# EAGLE design WatchX-BASIC-TOP (EAGLE 9.6.2)
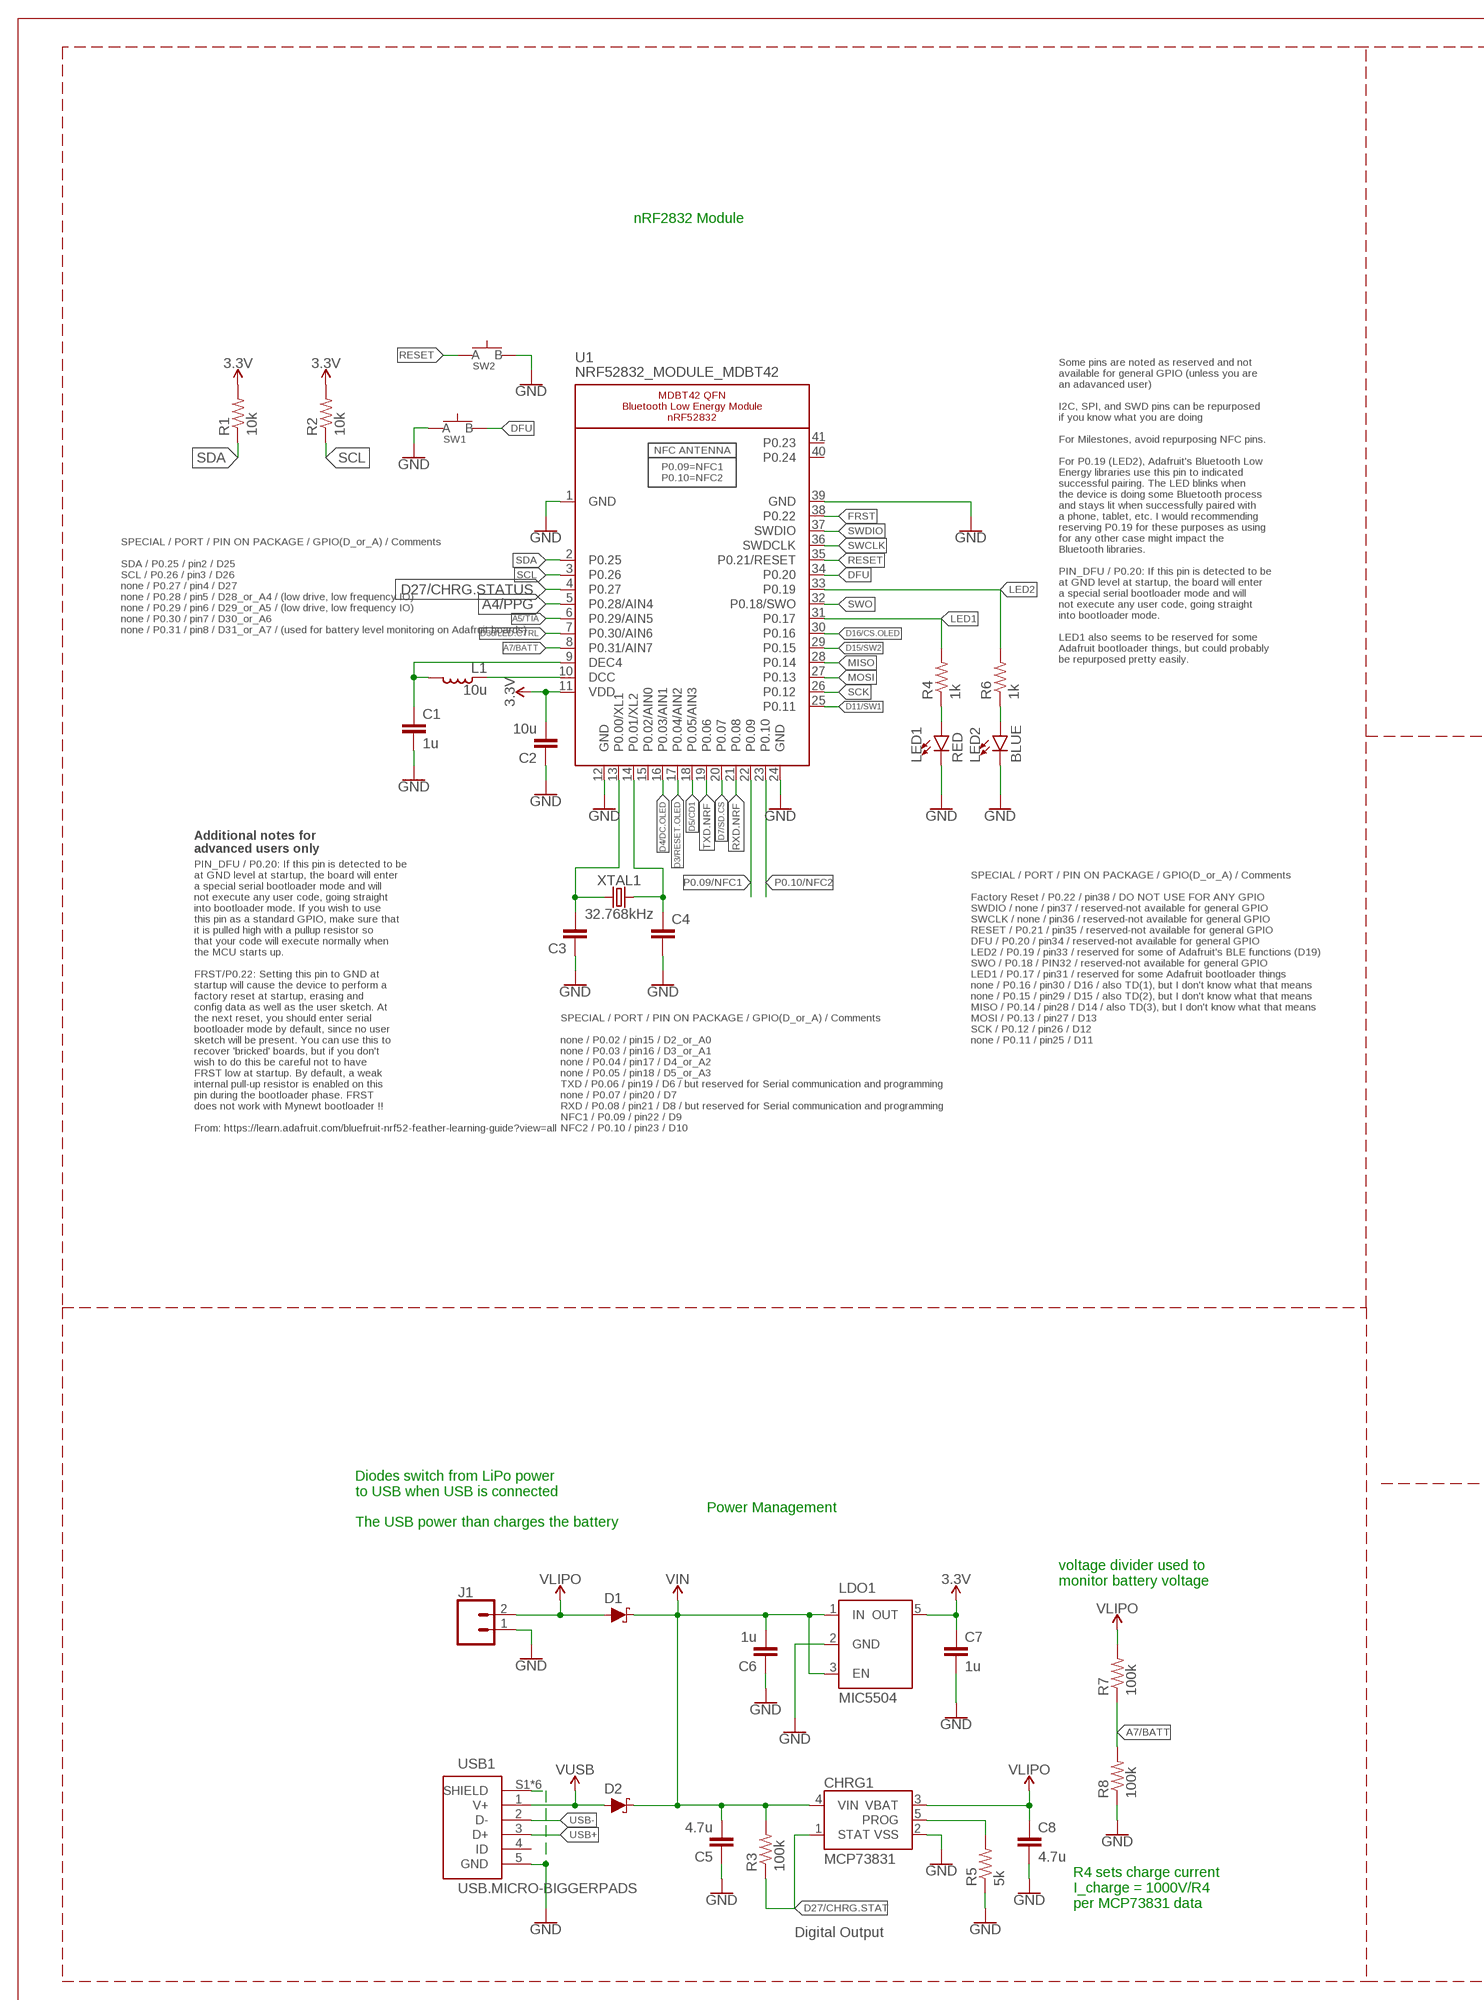
[diagram p0: schematic, sheet 1, part 1 of 2]
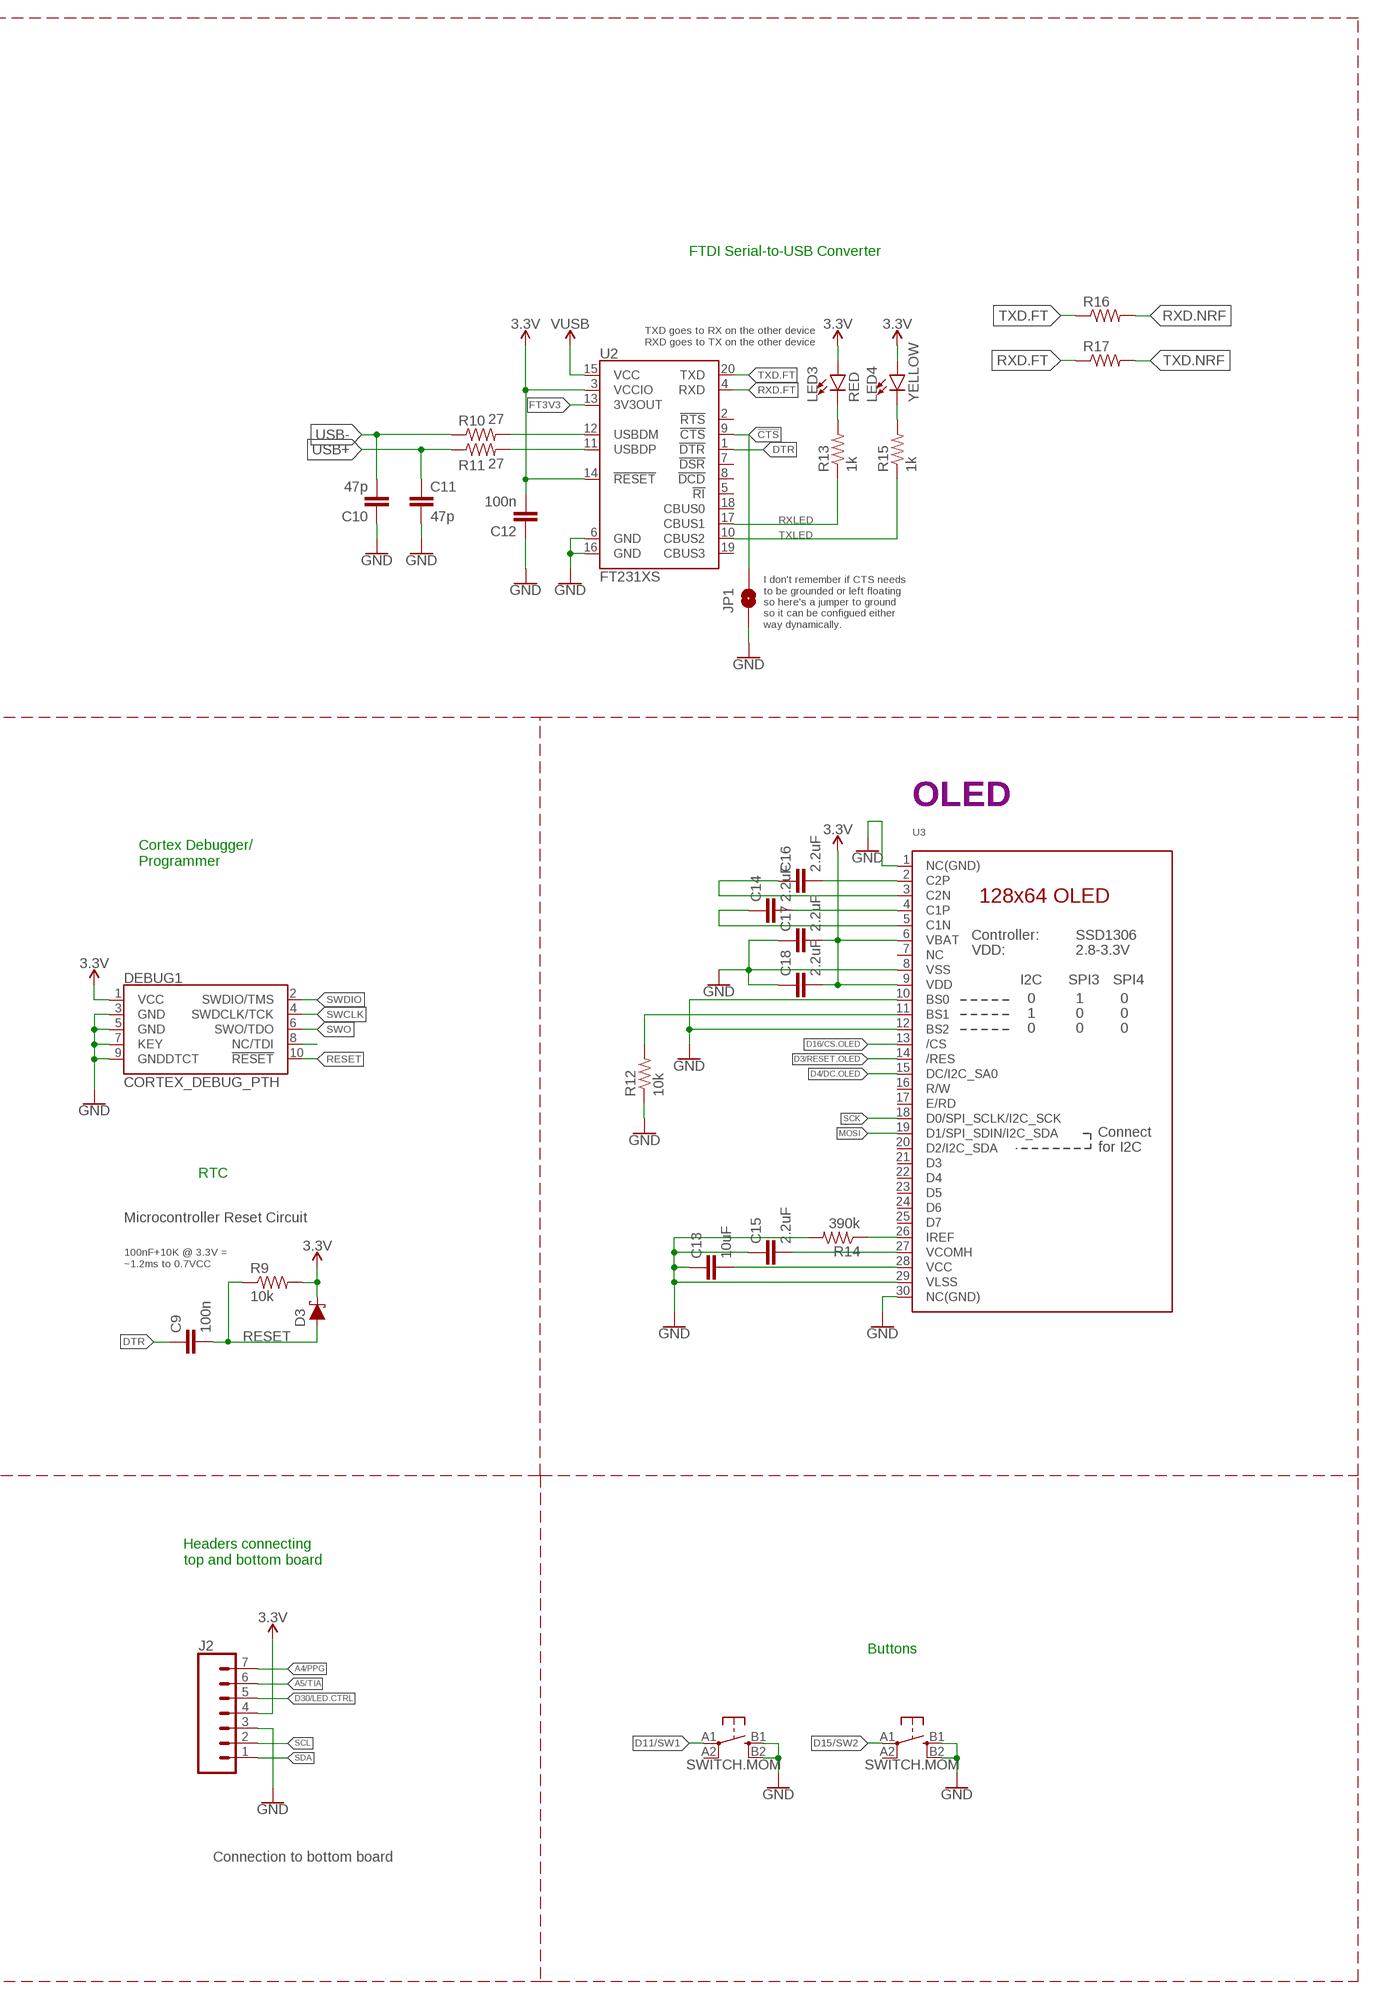
[diagram p1: schematic, sheet 1, part 2 of 2]

## Parts
C1  1u  CAPACITOR0603  [C0603]
C2  10u  CAPACITOR0805  [C0805]
C3  CAPACITOR0603  [C0603]
C4  CAPACITOR0603  [C0603]
C5  4.7u  CAPACITOR0603  [C0603]
C6  1u  CAPACITOR0603  [C0603]
C7  1u  CAPACITOR0603  [C0603]
C8  4.7u  CAPACITOR0603  [C0603]
C9  100n  CAPACITOR0603  [C0603]
C10  47p  CAPACITOR0603  [C0603]
C11  47p  CAPACITOR0603  [C0603]
C12  100n  CAPACITOR0603  [C0603]
C13  10uF  CAPACITOR0603  [C0603]
C14  2.2uF  CAPACITOR0402  [C0402]
C15  2.2uF  CAPACITOR0603  [C0603]
C16  2.2uF  CAPACITOR0402  [C0402]
C17  2.2uF  CAPACITOR0402  [C0402]
C18  2.2uF  CAPACITOR0402  [C0402]
CHRG1  MCP73831  [SOT23-5]
D1  SCHOTTKY-USC  [USC]
D2  SCHOTTKY-USC  [USC]
D3  SCHOTTKY-USC  [USC]
DEBUG1  CORTEX_DEBUG_PTH  [2X5-PTH-1.27MM]
J1  CONN_02  [1X02]
J2  CONN_07-1.27MM  [1X07_1.27MM]
JP1  JUMPER-SMT_2_NO_SILK  [SMT-JUMPER_2_NO_SILK]
L1  10u  INDUCTOR0603  [L0603]
LDO1  MIC5504  [SOT23-5]
LED1  RED  LED0603  [LED-0603]
LED2  BLUE  LED0603  [LED-0603]
LED3  RED  LED0603  [LED-0603]
LED4  YELLOW  LED0603  [LED-0603]
R1  10k  RESISTOR0603  [R0603]
R2  10k  RESISTOR0603  [R0603]
R3  100k  RESISTOR0603  [R0603]
R4  1k  RESISTOR0603  [R0603]
R5  5k  RESISTOR0603  [R0603]
R6  1k  RESISTOR0603  [R0603]
R7  100k  RESISTOR0603  [R0603]
R8  100k  RESISTOR0603  [R0603]
R9  10k  RESISTOR0603  [R0603]
R10  27  RESISTOR0603  [R0603]
R11  27  RESISTOR0603  [R0603]
R12  10k  RESISTOR0603  [R0603]
R13  1k  RESISTOR0603  [R0603]
R14  390k  RESISTOR0603  [R0603]
R15  1k  RESISTOR0603  [R0603]
R16  RESISTOR0603  [R0603]
R17  RESISTOR0603  [R0603]
SW1  SPST-PTS830GG140-COPY.1-3  [BUTTON-GULLWING]
SW2  SPST-PTS830GG140-COPY.1-3  [BUTTON-GULLWING]
SW3  SWITCH.MOM  [TACTILE_SWITCH_SMD_6.2MM_TALL]
SW4  SWITCH.MOM  [TACTILE_SWITCH_SMD_6.2MM_TALL]
U1  NRF52832_MODULE_MDBT42  [BLE_MODULE_RAYTAC_MDBT42]
U2  FT231XS  [SSOP20_L]
U3  DISP_OLED_UG-2864HSWEG01-NO-WRAPAROUND  [UG-2864HSWEG01_0.96IN_NO-WRAPAROUND]
USB1  USB.MICRO-BIGGERPADS  [USB-MICRO-01.BIGGERPADS]
XTAL1  32.768kHz  CRYSTALECS-.327-12.5-12-C-TR  [2-SMD.NOLEAD.2.0MMTO1.2MM]

## Nets
3.3V: C2.2 C7.1 C12.2 C17.2 C18.2 D3.-(C) DEBUG1.1(VCC) J2.4 LDO1.5(OUT) LED3.A LED4.A R1.2 R2.2 R9.2 U1.11(VDD) U2.3(VCCIO) U2.14(!RESET) U3.6(VBAT) U3.9(VDD)
!CTS: JP1.2 U2.9(!CTS)
A4/PPG: J2.7 U1.5(P0.28/AIN4)
A5/TIA: J2.6 U1.6(P0.29/AIN5)
A7/BATT: R7.1 R8.2 U1.8(P0.31/AIN7)
D3/RESET.OLED: U1.17(P0.04/AIN2) U3.14(/RES)
D4/DC.OLED: U1.16(P0.03/AIN1) U3.15(DC/I2C_SA0)
D5/CD1: U1.18(P0.05/AIN3)
D7/SD.CS: U1.20(P0.07)
D11/SW1: SW3.A1 U1.25(P0.11)
D15/SW2: SW4.A1 U1.29(P0.15)
D16/CS.OLED: U1.30(P0.16) U3.13(/CS)
D27/CHRG.STAT: CHRG1.1(STAT) R3.1
D27/CHRG.STATUS: U1.4(P0.27)
D30/LED.CTRL: J2.5 U1.7(P0.30/AIN6)
DFU: SW1.3(B) U1.34(P0.20)
DTR: C9.1 U2.1(!DTR)
FRST: U1.38(P0.22)
FT3V3: U2.13(3V3OUT)
GND: C1.2 C2.1 C3.1 C4.2 C5.1 C6.1 C7.2 C8.2 C10.1 C11.2 C12.1 C13.1 C15.1 C17.1 C18.1 CHRG1.2(VSS) DEBUG1.3(GND) DEBUG1.5(GND) DEBUG1.7(KEY) DEBUG1.9(GNDDTCT) J1.1 J2.3 JP1.1 LDO1.2(GND) LED1.C LED2.C R5.1 R8.1 R12.1 R14.2 SW1.1(A) SW2.3(B) SW3.B1 SW3.B2 SW4.B1 SW4.B2 U1.1(GND) U1.12(GND) U1.24(GND) U1.39(GND) U2.6(GND) U2.16(GND) U3.1(NC(GND)) U3.8(VSS) U3.10(BS0) U3.12(BS2) U3.29(VLSS) U3.30(NC(GND)) USB1.5(GND) USB1.S1(SHIELD) USB1.S2(SHIELD) USB1.S3(SHIELD) USB1.S4(SHIELD) USB1.S5(SHIELD) USB1.S6(SHIELD)
LED1: R4.2 U1.31(P0.17)
LED2: R6.2 U1.33(P0.19)
MISO: U1.28(P0.14)
MOSI: U1.27(P0.13) U3.19(D1/SPI_SDIN/I2C_SDA)
N$1: R12.2 U3.11(BS1)
N$2: R14.1 U3.26(IREF)
N$3: C16.2 U3.2(C2P)
N$4: C3.2 U1.13(P0.00/XL1) XTAL1.P$1
N$5: C16.1 U3.3(C2N)
N$6: C4.1 U1.14(P0.01/XL2) XTAL1.P$2
N$7: C14.2 U3.4(C1P)
N$8: C14.1 U3.5(C1N)
N$9: LED1.A R4.1
N$10: LED2.A R6.1
N$11: L1.1 U1.10(DCC)
N$12: C1.1 L1.2 U1.9(DEC4)
N$13: C13.2 U3.28(VCC)
N$14: DEBUG1.8(NC/TDI)
N$15: C15.2 U3.27(VCOMH)
N$17: CHRG1.5(PROG) R5.2
N$23: R10.2 U2.12(USBDM)
N$24: R11.2 U2.11(USBDP)
N$25: LED3.C R13.2
N$26: LED4.C R15.2
P0.09/NFC1: U1.22(P0.09)
P0.10/NFC2: U1.23(P0.10)
RESET: C9.2 D3.+(A) DEBUG1.10(!RESET) R9.1 SW2.1(A) U1.35(P0.21/RESET)
RXD.FT: R17.1 U2.4(RXD)
RXD.NRF: R16.2 U1.21(P0.08)
RXLED: R13.1 U2.17(CBUS1)
SCK: U1.26(P0.12) U3.18(D0/SPI_SCLK/I2C_SCK)
SCL: J2.2 R2.1 U1.3(P0.26)
SDA: J2.1 R1.1 U1.2(P0.25)
SWCLK: DEBUG1.4(SWDCLK/TCK) U1.36(SWDCLK)
SWDIO: DEBUG1.2(SWDIO/TMS) U1.37(SWDIO)
SWO: DEBUG1.6(SWO/TDO) U1.32(P0.18/SWO)
TXD.FT: R16.1 U2.20(TXD)
TXD.NRF: R17.2 U1.19(P0.06)
TXLED: R15.1 U2.10(CBUS2)
USB+: C11.1 R11.1 USB1.3(D+)
USB-: C10.2 R10.1 USB1.2(D-)
V_USB: D2.+(A) U2.15(VCC) USB1.1(V+) ; supply symbol labelled VUSB
VIN: C5.2 C6.2 CHRG1.4(VIN) D1.-(C) D2.-(C) LDO1.1(IN) LDO1.3(EN) R3.2
VLIPO: C8.1 CHRG1.3(VBAT) D1.+(A) J1.2 R7.2
Unconnected: SW3.A2 SW4.A2 U1.15(P0.02/AIN0) U1.40(P0.24) U1.41(P0.23) U2.2(!RTS) U2.5(!RI) U2.7(!DSR) U2.8(!DCD) U2.18(CBUS0) U2.19(CBUS3) U3.7(NC) U3.16(R/W) U3.17(E/RD) U3.20(D2/I2C_SDA) U3.21(D3) U3.22(D4) U3.23(D5) U3.24(D6) U3.25(D7) USB1.4(ID)

## Notes on the sheet
- nRF2832 Module
- FTDI Serial-to-USB Converter
- TXD goes to RX on the other device
  RXD goes to TX on the other device
- SPECIAL / PORT / PIN ON PACKAGE / GPIO(D_or_A) / Comments
  
  SDA / P0.25 / pin2 / D25
  SCL / P0.26 / pin3 / D26
  none / P0.27 / pin4 / D27
  none / P0.28 / pin5 / D28_or_A4 / (low drive, low frequency IO)
  none / P0.29 / pin6 / D29_or_A5 / (low drive, low frequency IO)
  none / P0.30 / pin7 / D30_or_A6
  none / P0.31 / pin8 / D31_or_A7 / (used for battery level monitoring on Adafruit boards)
- I don't remember if CTS needs
  to be grounded or left floating
  so here's a jumper to ground
  so it can be configued either
  way dynamically.
- Some pins are noted as reserved and not
  available for general GPIO (unless you are
  an adavanced user)
  
  I2C, SPI, and SWD pins can be repurposed
  if you know what you are doing
  
  For Milestones, avoid repurposing NFC pins.
  
  For P0.19 (LED2), Adafruit's Bluetooth Low
  Energy libraries use this pin to indicated
  successful pairing. The LED blinks when
  the device is doing some Bluetooth process
  and stays lit when successfully paired with
  a phone, tablet, etc. I would recommending
  reserving P0.19 for these purposes as using
  for any other case might impact the
  Bluetooth libraries.
  
  PIN_DFU / P0.20: If this pin is detected to be
  at GND level at startup, the board will enter
  a special serial bootloader mode and will
  not execute any user code, going straight
  into bootloader mode.
  
  LED1 also seems to be reserved for some
  Adafruit bootloader things, but could probably
  be repurposed pretty easily.
- OLED
- Additional notes for
  advanced users only
- Cortex Debugger/
  Programmer
- SPECIAL / PORT / PIN ON PACKAGE / GPIO(D_or_A) / Comments
  
  Factory Reset / P0.22 / pin38 / DO NOT USE FOR ANY GPIO
  SWDIO / none / pin37 / reserved-not available for general GPIO
  SWCLK / none / pin36 / reserved-not available for general GPIO
  RESET / P0.21 / pin35 / reserved-not available for general GPIO
  DFU / P0.20 / pin34 / reserved-not available for general GPIO
  LED2 / P0.19 / pin33 / reserved for some of Adafruit's BLE functions (D19)
  SWO / P0.18 / PIN32 / reserved-not available for general GPIO
  LED1 / P0.17 / pin31 / reserved for some Adafruit bootloader things
  none / P0.16 / pin30 / D16 / also TD(1), but I don't know what that means
  none / P0.15 / pin29 / D15 / also TD(2), but I don't know what that means
  MISO / P0.14 / pin28 / D14 / also TD(3), but I don't know what that means
  MOSI / P0.13 / pin27 / D13
  SCK / P0.12 / pin26 / D12
  none / P0.11 / pin25 / D11
- PIN_DFU / P0.20: If this pin is detected to be
  at GND level at startup, the board will enter
  a special serial bootloader mode and will
  not execute any user code, going straight
  into bootloader mode. If you wish to use
  this pin as a standard GPIO, make sure that
  it is pulled high with a pullup resistor so
  that your code will execute normally when
  the MCU starts up.
  
  FRST/P0.22: Setting this pin to GND at
  startup will cause the device to perform a
  factory reset at startup, erasing and
  config data as well as the user sketch. At
  the next reset, you should enter serial
  bootloader mode by default, since no user
  sketch will be present. You can use this to
  recover 'bricked' boards, but if you don't
  wish to do this be careful not to have
  FRST low at startup. By default, a weak
  internal pull-up resistor is enabled on this
  pin during the bootloader phase. FRST
  does not work with Mynewt bootloader !!
  
  From: https://learn.adafruit.com/bluefruit-nrf52-feather-learning-guide?view=all
- SPECIAL / PORT / PIN ON PACKAGE / GPIO(D_or_A) / Comments
  
  none / P0.02 / pin15 / D2_or_A0
  none / P0.03 / pin16 / D3_or_A1
  none / P0.04 / pin17 / D4_or_A2
  none / P0.05 / pin18 / D5_or_A3
  TXD / P0.06 / pin19 / D6 / but reserved for Serial communication and programming
  none / P0.07 / pin20 / D7
  RXD / P0.08 / pin21 / D8 / but reserved for Serial communication and programming
  NFC1 / P0.09 / pin22 / D9
  NFC2 / P0.10 / pin23 / D10
- RTC
- Microcontroller Reset Circuit
- 100nF+10K @ 3.3V =
  ~1.2ms to 0.7VCC
- Power Management
- Diodes switch from LiPo power
  to USB when USB is connected 
  
  The USB power than charges the battery
- Headers connecting 
  top and bottom board
- voltage divider used to 
  monitor battery voltage
- Buttons
- Connection to bottom board
- R4 sets charge current
  I_charge = 1000V/R4
  per MCP73831 data
- Digital Output

## Library data of the parts
C1-C18 = LinnesLab-Passives:CAPACITOR
CHRG1 = LinnesLab-Power:MCP73831: MCP73831T Li-Ion, Li-Pol Controller Miniature single cell, fully integrated Li-Ion, Li-polymer charge management controller Datasheet <http://ww1.microchip.com/downloads/en/DeviceDoc/20001984g.pdf> SparkFun Products: SparkFun ESP32 Thing <https://www.sparkfun.com/products/13907> SparkFun 9DoF Razor IMU M0 <https://www.sparkfun.com/products/14001>; PROD_ID: IC-09995
D1-D3 = LinnesLab-DiscreteSemi:SCHOTTKY: Schottky diode A Schottky diode is a semiconductor diode which has a low forward voltage drop and a very fast switching action. Example: Digi-Key Part Number: RB161MM-20CT-ND
DEBUG1 = LinnesLab-Connectors:CORTEX_DEBUG: Cortex Debug Connector - 10 pin Supports JTAG debug, Serial Wire debug, and Serial Wire Viewer. PTH and SMD connector options available. General Connector Information <http://infocenter.arm.com/help/topic/com.arm.doc.faqs/attached/13634/cortex_debug_connectors.pdf> Products: PTH Connector <http://www.digikey.com/product-detail/en/cnc-tech/3220-10-0100-00/1175-1627-ND/3883661> -via Digi-Key SparkFun PSoc <https://www.sparkfun.com/products/13229> SparkFun T <https://www.sparkfun.com/products/13810>
J1 = LinnesLab-Connectors:CONN_02: Multi connection point. Often used as Generic Header-pin footprint for 0.1 inch spaced/style header connections On any of the 0.1 inch spaced packages, you can populate with these: Break Away Headers - Straight <https://www.sparkfun.com/products/116> (PRT-00116) Break Away Male Headers - Right Angle <https://www.sparkfun.com/products/553> (PRT-00553) Female Headers <https://www.sparkfun.com/products/115> (PRT-00115) Break Away Headers - Machine Pin <https://www.sparkfun.com/products/117> (PRT-00117) Break Away Female Headers - Swiss Machine Pin <https://www.sparkfun.com/products/743> (PRT-00743) For SCREWTERMINALS and SPRING TERMINALS visit here: Screw Terimnals on SparkFun.com <https://www.sparkfun.com/search/results?term=Screw+Terminals> (5mm/3.5mm/2.54mm spacing) This device is also useful as a general connection point to wire up your design to another part of your project. Our various solder wires solder well into these plated through hole pads. Hook-Up Wire - Assortment (Stranded, 22 AWG) <https://www.sparkfun.com/products/11375> (PRT-11375) Hook-Up Wire - Assortment (Solid Core, 22 AWG) <https://www.sparkfun.com/products/11367> (PRT-11367) View the entire wire category on our website here <https://www.sparkfun.com/categories/141> Special notes: Molex polarized connector foot print use with: PRT-08233 with associated crimp pins and housings. 2.54_SCREWTERM for use with PRT-10571. 3.5mm Screw Terminal footprints for PRT-08084 5mm Screw Terminal footprints for use with PRT-08432
J2 = LinnesLab-Connectors:CONN_07: Multi connection point. Often used as Generic Header-pin footprint for 0.1 inch spaced/style header connections On any of the 0.1 inch spaced packages, you can populate with these: Break Away Headers - Straight <https://www.sparkfun.com/products/116> (PRT-00116) Break Away Male Headers - Right Angle <https://www.sparkfun.com/products/553> (PRT-00553) Female Headers <https://www.sparkfun.com/products/115> (PRT-00115) Break Away Headers - Machine Pin <https://www.sparkfun.com/products/117> (PRT-00117) Break Away Female Headers - Swiss Machine Pin <https://www.sparkfun.com/products/743> (PRT-00743) For SCREWTERMINALS and SPRING TERMINALS visit here: Screw Terimnals on SparkFun.com <https://www.sparkfun.com/search/results?term=Screw+Terminals> (5mm/3.5mm/2.54mm spacing) This device is also useful as a general connection point to wire up your design to another part of your project. Our various solder wires solder well into these plated through hole pads. Hook-Up Wire - Assortment (Stranded, 22 AWG) <https://www.sparkfun.com/products/11375> (PRT-11375) Hook-Up Wire - Assortment (Solid Core, 22 AWG) <https://www.sparkfun.com/products/11367> (PRT-11367) View the entire wire category on our website here <https://www.sparkfun.com/categories/141> Special notes: Molex polarized connector foot print use with SKU : PRT-08231 with associated crimp pins and housings. 1MM SMD Version SKU: PRT-10208 NOTES ON THE VARIANTS LOCK and LOCK_LONGPADS... This footprint was designed to help hold the alignment of a through-hole component (i.e. 6-pin header) while soldering it into place. You may notice that each hole has been shifted either up or down by 0.005 of an inch from it's more standard position (which is a perfectly straight line). This slight alteration caused the pins (the squares in the middle) to touch the edges of the holes. Because they are alternating, it causes a "brace" to hold the component in place. 0.005 has proven to be the perfect amount of "off-center" position when using our standard breakaway headers. Although looks a little odd when you look at the bare footprint, once you have a header in there, the alteration is very hard to notice. Also,if you push a header all the way into place, it is covered up entirely on the bottom side.
JP1 = LinnesLab-Switches:JUMPER-SMT_2_NO: Normally open jumper This jumper has two pads in close proximity to each other. Apply solder to close the connection. Round pads are easier to solder for beginners, but are a lot larger. SparkFun Product that uses the round pads: SparkFun EL Sequencer <https://www.sparkfun.com/products/12781>
L1 = LinnesLab-Passives:INDUCTOR
LDO1 = LinnesLab-Power:MIC5504: MIC5504 Voltage Regulator Output Voltages: 1.0V to 3.3V Input Voltages: 2.5V to 5.5V Link to Datasheet http://ww1.microchip.com/downloads/en/DeviceDoc/MIC550X.pdf
LED1-LED4 = LinnesLab-LED:LED: LED (Generic) Standard schematic elements and footprints for 5mm, 3mm, 1206, and 0603 sized LEDs. Generic LEDs with no color specified. LTST-C190KGKT: arrow indicates cathode
R1-R17 = LinnesLab-Passives:RESISTOR
SW1 SW2 = LinnesLab-Switches:SPST-PTS830GG140-COPY
SW3 SW4 = LinnesLab-Switches:SWITCH.MOM: PTS645SM43SMTR92 LFS
U1 = LinnesLab-Microcontrollers:NRF52832_MODULE_MDBT42: MDBT42 - BLE Module (nRF52832 QFN) VDD: 1.7-3.6V
U2 = LinnesLab-DigitalIC:FT231X: FTDI FT231X Full Speed USB to Full-handshake UART This USB2.0 Full Speed IC offers a compact bridge to full handshake UART interfaces. The device is a UART, capable of operating up to 3MBaud, with low power consumption (8mA). The FT231X includes the complete FT-X series feature set and enables USB to be added into a system design quickly and easily over a UART interface. Datasheet <http://cdn.sparkfun.com/datasheets/Components/General%20IC/DS_FT231X.pdf>; DIGIKEY: 768-1156-5-ND; MFN: FT231XS-U
U3 = LinnesLab-Displays:DISP_OLED_UG-2864HSWEG01: UG-2864HSWEG01 OLED display Both 1.3" and 0.96" models share the same FPC tab footprint, only the screen dimensions vary.
USB1 = LinnesLab-Connectors:USB.MICRO: DigiKey PN: 609-4613-1-ND
XTAL1 = LinnesLab-Clocks:CRYSTAL; DIGIKEY: XC2288CT-ND; FREQ: 32.7680KHZ; LOAD_CAP: 12.5pF

## Board
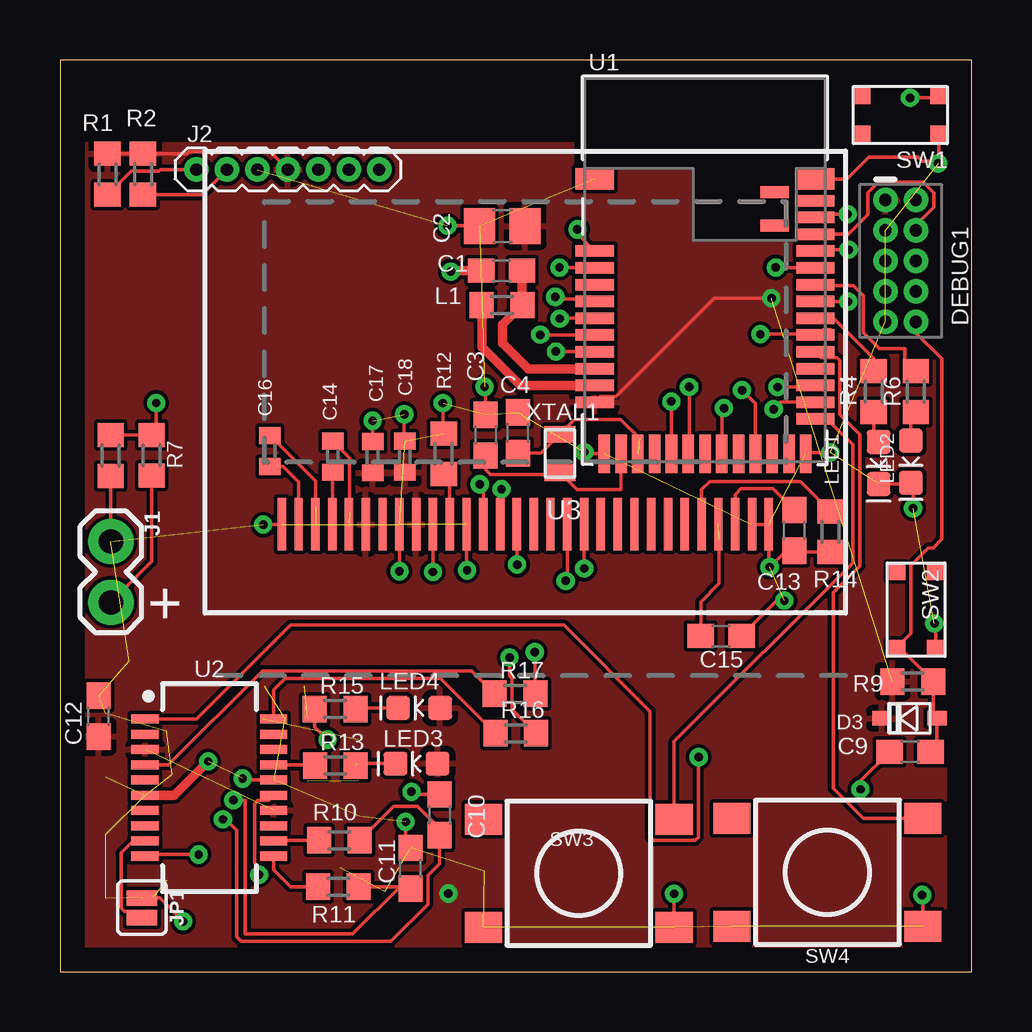
[diagram p2: board, top side]
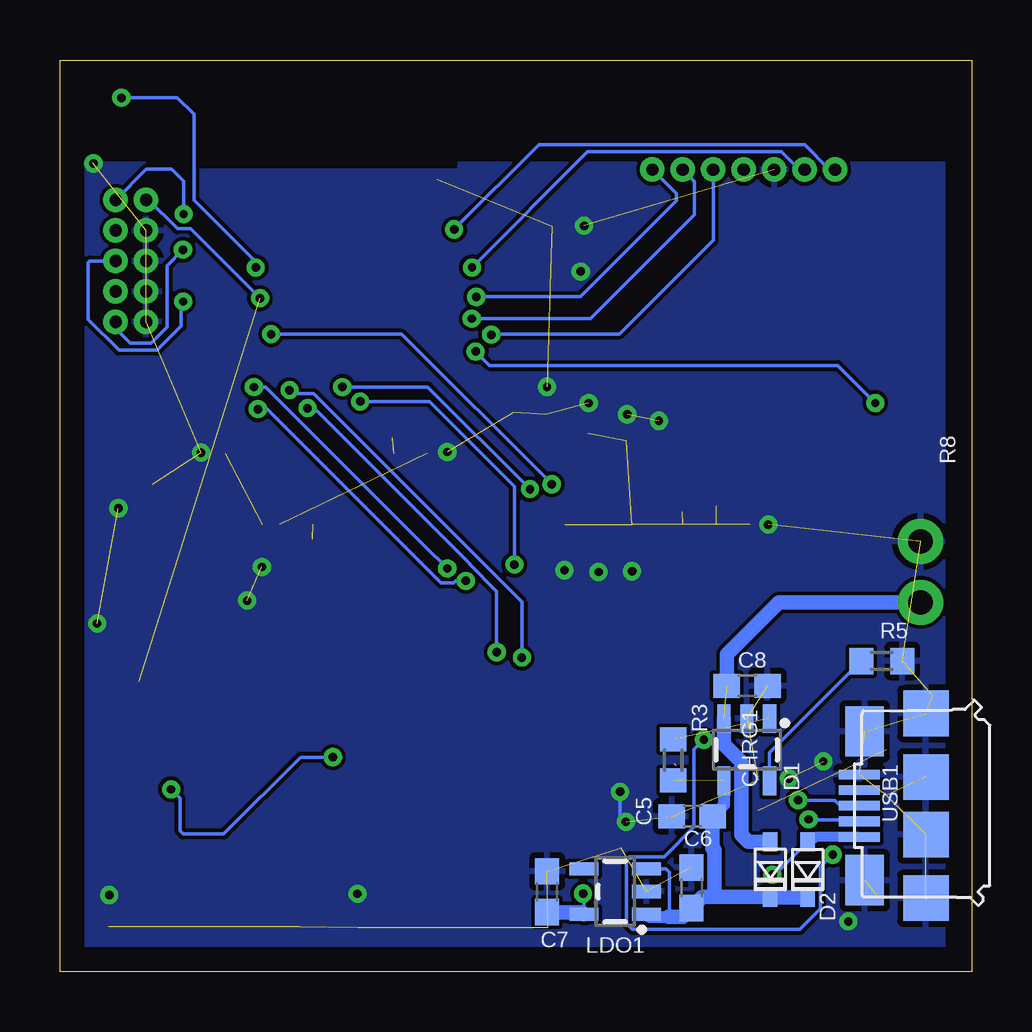
[diagram p3: board, bottom side, seen from below]

Size 38 x 38 mm. Coordinates in mm from the lower left corner, seen from the top.
Outline: 0,0 38,0 38,38 0,38 0,0
Copper layers (1*16): Top 0.035mm / dielectric 1.5mm / Bottom 0.035mm
Design rules "default": minimum track width 6mil, minimum drill 0.35mm, track to track 6mil, track to pad 6mil, pad to pad 6mil, via to via 6mil, smd to smd 6mil, copper to edge 40mil, drill to drill 6mil, minimum pad ring 10mil, minimum via ring 8mil, stop-mask expansion 4mil, vias tented up to drill 0mil, thermal gap 10mil

### Footprints (pad centres in the part's own frame; a part is rotated, then mirrored left to right if it is on the bottom)
C0603 = smd 1.1 x 1: 1 -0.85,0; 2 0.85,0
C0805 = smd 1.3 x 1.5: 1 -0.95,0; 2 0.95,0
C0402 = smd 0.7 x 0.9: 1 -0.65,0; 2 0.65,0
SOT23-5 = smd 0.55 x 1.2: 1 -0.95,-1.3; 2 0,-1.3; 3 0.95,-1.3; 4 0.95,1.3; 5 -0.95,1.3
USC = smd 0.8 x 0.6: + -1.15,0; - 1.15,0
2X5-PTH-1.27MM = drill 0.508 pad 1: 1 -2.54,-0.635; 2 -2.54,0.635; 3 -1.27,-0.635; 4 -1.27,0.635; 5 0,-0.635; 6 0,0.635; 7 1.27,-0.635; 8 1.27,0.635; 9 2.54,-0.635; 10 2.54,0.635
1X02 = drill 1.016 pad 1.88: 1 0,0; 2 2.54,0
1X07_1.27MM = drill 0.508 pad 1: 1 0,0; 2 1.27,0; 3 2.54,0; 4 3.81,0; 5 5.08,0; 6 6.35,0; 7 7.62,0
SMT-JUMPER_2_NO_SILK = smd 0.635 x 1.27: 1 -0.406,0; 2 0.406,0
L0603 = smd 1 x 1.1: 1 -0.85,0; 2 0.85,0
LED-0603 = smd 1 x 1: A -0.877,0; C 0.877,0
R0603 = smd 1 x 1.1: 1 -0.85,0; 2 0.85,0
BUTTON-GULLWING = smd 0.7 x 0.75: 1 -1.6,0.825; 2 1.6,0.825; 3 -1.6,-0.825; 4 1.6,-0.825
TACTILE_SWITCH_SMD_6.2MM_TALL = smd 1.55 x 1.3: A1 -3.975,-2.25; A2 3.975,-2.25; B1 -3.975,2.25; B2 3.975,2.25
BLE_MODULE_RAYTAC_MDBT42 = smd 1.6 x 0.9: 1 -4.6,3.8; 39 4.6,3.8 | smd 1.6 x 0.48: 2 -4.6,0.8; 3 -4.6,0.1; 4 -4.6,-0.6; 5 -4.6,-1.3; 6 -4.6,-2; 7 -4.6,-2.7; 8 -4.6,-3.4; 9 -4.6,-4.1; 10 -4.6,-4.8; 11 -4.6,-5.5; 25 4.6,-6.2; 26 4.6,-5.5; 27 4.6,-4.8; 28 4.6,-4.1; 29 4.6,-3.4; 30 4.6,-2.7; 31 4.6,-2; 32 4.6,-1.3; 33 4.6,-0.6; 34 4.6,0.1; 35 4.6,0.8; 36 4.6,1.5; 37 4.6,2.2; 38 4.6,2.9 | smd 0.48 x 1.6: 12 -4.2,-7.65; 13 -3.5,-7.65; 14 -2.8,-7.65; 15 -2.1,-7.65; 16 -1.4,-7.65; 17 -0.7,-7.65; 18 0,-7.65; 19 0.7,-7.65; 20 1.4,-7.65; 21 2.1,-7.65; 22 2.8,-7.65; 23 3.5,-7.65; 24 4.2,-7.65 | smd 1.2 x 0.5: 40 2.9,3.25; 41 2.9,1.85
SSOP20_L = smd 0.381 x 1.143: 1 -2.857,-2.68; 2 -2.223,-2.68; 3 -1.587,-2.68; 4 -0.953,-2.68; 5 -0.318,-2.68; 6 0.318,-2.68; 7 0.953,-2.68; 8 1.587,-2.68; 9 2.223,-2.68; 10 2.857,-2.68; 11 2.857,2.68; 12 2.223,2.68; 13 1.587,2.68; 14 0.953,2.68; 15 0.318,2.68; 16 -0.318,2.68; 17 -0.953,2.68; 18 -1.587,2.68; 19 -2.223,2.68; 20 -2.857,2.68
UG-2864HSWEG01_0.96IN_NO-WRAPAROUND = smd 0.35 x 2.2: 1 -10.15,-1.2; 2 -9.45,-1.2; 3 -8.75,-1.2; 4 -8.05,-1.2; 5 -7.35,-1.2; 6 -6.65,-1.2; 7 -5.95,-1.2; 8 -5.25,-1.2; 9 -4.55,-1.2; 10 -3.85,-1.2; 11 -3.15,-1.2; 12 -2.45,-1.2; 13 -1.75,-1.2; 14 -1.05,-1.2; 15 -0.35,-1.2; 16 0.35,-1.2; 17 1.05,-1.2; 18 1.75,-1.2; 19 2.45,-1.2; 20 3.15,-1.2; 21 3.85,-1.2; 22 4.55,-1.2; 23 5.25,-1.2; 24 5.95,-1.2; 25 6.65,-1.2; 26 7.35,-1.2; 27 8.05,-1.2; 28 8.75,-1.2; 29 9.45,-1.2; 30 10.15,-1.2
USB-MICRO-01.BIGGERPADS = smd 0.4 x 1.7: 1 -1.3,1.505; 2 -0.65,1.505; 3 0,1.505; 4 0.65,1.505; 5 1.3,1.505 | smd 1.9 x 1.9: S1 -3.85,-1.27; S2 -1.2,-1.27; S3 1.2,-1.27; S4 3.85,-1.27 | smd 2.1 x 1.6: S5 -3.1,1.28; S6 3.1,1.28
2-SMD.NOLEAD.2.0MMTO1.2MM = smd 0.7 x 1.3: P$1 -0.8,0; P$2 0.8,0

### Placement (x,y rotation side)
C1  18.41,29.22 180 top
C2  18.44,31.07 0 top
C3  17.74,22.36 270 top
C4  19.1,22.46 90 top
C5  11.64,6.48 0 bottom
C6  11.68,3.49 270 bottom
C7  17.69,3.33 90 bottom
C8  9.35,11.91 0 bottom
C9  35.44,9.16 0 top
C10  15.82,6.53 270 top
C11  14.61,4.31 90 top
C12  1.61,10.64 270 top
C13  30.61,18.39 90 top
C14  11.37,21.46 270 top
C15  27.56,13.98 180 top
C16  8.75,21.7 270 top
C17  13.03,21.44 270 top
C18  14.38,21.46 270 top
CHRG1  9.37,9.25 180 bottom
D1  8.4,4.26 270 bottom
D2  6.83,4.25 270 bottom
D3  35.41,10.56 180 top
DEBUG1  35.05,29.62 270 top
J1  2.12,17.93 270 top
J2  5.69,33.43 0 top
JP1  3.41,2.66 270 top
L1  18.42,27.78 0 top
LDO1  14.86,3.33 90 bottom
LED1  34.13,21.2 270 top
LED2  35.47,21.25 270 top
LED3  14.86,8.67 180 top
LED4  14.97,10.99 180 top
R1  1.98,33.23 90 top
R2  3.46,33.24 90 top
R3  12.44,8.82 270 bottom
R4  33.92,24.17 90 top
R5  3.74,12.94 180 bottom
R6  35.68,24.18 90 top
R7  3.82,21.52 270 top
R8  2.12,21.52 90 top
R9  35.55,12.09 180 top
R10  11.64,5.47 180 top
R11  11.61,3.54 180 top
R12  15.99,21.59 270 top
R13  11.48,8.59 0 top
R14  32.12,18.34 270 top
R15  11.47,10.94 0 top
R16  19,9.93 0 top
R17  18.97,11.58 0 top
SW1  35.03,35.7 180 top
SW2  35.69,15.08 90 top
SW3  21.63,4.1 180 top
SW4  31.99,4.14 180 top
U1  26.89,29.23 0 top
U2  6.23,7.67 270 top
U3  19.4,19.84 0 top
USB1  3.17,6.91 90 bottom
XTAL1  20.84,21.6 90 top

### Tracks (layer width: path | path; a pad name or v marks a point on that pad's centre or on a via)
3.3V  (via drill 0.35)  (2 unrouted)
  Top 0.152: R1.2 1.99,34.09 R2.2 5.31,34.09 5.38,34.17 8.76,34.17 J2.4 | U1.11 22.52,23.96 23.18,23.96 27.29,28.07 v29.66,28.07
  Top 0.4: 21.68,23.73 U1.11
  Bottom 0.152: LDO1.5 16.16,3.21 v16.19,3.25 | v29.66,28.07 32.56,30.96 33.1,30.96 34.3,32.16 DEBUG1.1
  Bottom 0.61: C7.1 16.25,2.48 LDO1.5
  pour Top: 0.49,34.5 37.43,34.5 37.43,0.3 0.5,0.3 0.5,34.5
!CTS
  Top 0.152: JP1.2 3.15,2.52 2.68,2.52 2.55,2.65 2.55,4.94 3.06,5.45 U2.9
A4/PPG  (via drill 0.35)
  Top 0.152: U1.5 22.2,28.02 20.75,28.02 v20.65,28.13
  Bottom 0.152: v20.65,28.13 16.3,28.13 12.3,32.13 12.3,32.43 J2.7
A5/TIA  (via drill 0.35)
  Top 0.152: U1.6 20.85,27.23 v20.84,27.22
  Bottom 0.152: J2.6 11.54,32.94 11.54,31.55 15.88,27.22 v20.84,27.22
A7/BATT  (via drill 0.35)
  Top 0.152: R8.2 R7.1 4.01,22.55 v4.01,23.7 | U1.8 20.67,25.83 v20.67,25.85
  Bottom 0.152: v20.67,25.85 20.09,25.27 5.58,25.27 v4.01,23.7
D3/RESET.OLED  (via drill 0.35)
  Top 0.152: U3.14 18.41,18.7 v18.41,20.11 | v26.23,24.37 26.23,21.63 U1.17
  Bottom 0.152: v26.23,24.37 22.67,24.37 v18.41,20.11
D4/DC.OLED  (via drill 0.35)
  Top 0.152: U3.15 19.05,16.98 v19.05,16.97 | v25.48,23.76 U1.16
  Bottom 0.152: v19.05,16.97 19.05,20.22 22.59,23.76 v25.48,23.76
D11/SW1
  Top 0.152: SW3.A1 25.6,9.6 33.04,17.04 33.04,21.96 32.18,22.82 32.18,23.11 31.57,23.11 U1.25
D15/SW2
  Top 0.152: SW4.A1 33.48,6.39 32.24,7.63 32.24,15.8 33.35,16.91 33.35,22.38 32.52,23.21 32.52,25.47 32.38,25.6 31.72,25.6 U1.29
D16/CS.OLED  (via drill 0.35)
  Top 0.152: U3.13 17.65,20.17 v17.5,20.31 | v29.2,26.57 31.63,26.57 31.83,26.77 32.14,26.77 31.91,26.53 U1.30
  Bottom 0.152: v17.5,20.31 23.75,26.57 v29.2,26.57
D27/CHRG.STAT  (1 unrouted)
D30/LED.CTRL  (via drill 0.35)
  Top 0.152: U1.7 20.02,26.53 v20.02,26.55
  Bottom 0.152: v20.02,26.55 20,26.57 14.68,26.57 10.77,30.49 J2.5
DFU  (via drill 0.35)
  Top 0.152: U1.34 29.86,29.33 v29.84,29.35 | v35.44,36.42 36.53,36.42 SW1.3
  Bottom 0.152: v29.84,29.35 29.84,29.59 32.41,32.16 32.41,35.73 33.11,36.42 v35.44,36.42
DTR  (via drill 0.35)
  Top 0.152: U2.1 5.69,10.53 9.61,14.44 21.01,14.44 24.6,10.85 24.6,5.6 24.73,5.47 26.47,5.47 26.61,5.6 26.61,8.91 v26.63,8.94 | v33.37,7.59 33.37,7.95 C9.1
  Bottom 0.152: v26.63,8.94 27.98,8.94 31.18,5.74 32.87,5.74 33,5.87 33,7.22 v33.37,7.59
GND  (via drill 0.35)  (50 unrouted)
  Top 0.152: U3.1 v8.47,18.63 | C17.1 v13.03,22.95 | C18.1 14.35,22.14 v14.35,23.23 | R12.1 15.96,22.47 v15.96,23.7 | U3.8 v14.15,16.69 | U3.10 v15.55,16.66 | U3.12 16.95,16.75 v16.97,16.73 | U3.29 U3.30 29.55,16.9 v29.59,16.86 30.26,17.54 C13.1 30.66,17.49 R14.2 | C10.1 14.76,7.38 v14.65,7.49 | C11.2 14.41,5.35 v14.41,6.24 | R8.1 2.12,20.66 J1.1 | C3.1 17.74,24.33 v17.7,24.38 | U1.12 21.93,21.58 v21.86,21.66 | U1.24 31.14,21.63 v32.12,21.63 | SW3.B1 v25.6,3.24 | SW4.B1 35.97,3.17 v35.94,3.19 | LED1.C 35.42,20.32 LED2.C 35.56,20.29 v35.56,19.31 | SW1.1 36.63,33.71 | SW2.3 36.51,14.45 v36.45,14.51 | C15.1 29.89,15.47 v30.2,15.47 | C2.1 17.47,31.09 v16.15,31.09 | U2.16 7.67,7.99 v7.61,8.04 | 3.87,3.08 3.42,3.08 | U1.39 32.8,33.03 33.72,33.95 35.78,33.95 35.95,33.79 36.5,33.79 v36.61,33.69 | JP1.1 4.16,3.07 v5.13,2.09
  Top 0.4: U2.6 4.77,7.35 v6.17,8.76 | C1.2 16.33,29.22 v16.29,29.18
  Bottom 0.152: v14.41,6.24 14.65,6.48 v14.65,7.49
  pour Bottom: 1.13,33.7 37.58,33.7 37.58,0.1 1.15,0.1 1.15,33.68
LED1
  Top 0.152: R4.2 33.92,25.55 32.24,27.24 U1.31
LED2
  Top 0.152: R6.2 35.21,25.49 35.21,25.96 34.15,25.96 33.48,26.62 33.48,28.17 33.07,28.59 31.53,28.59 U1.33
MOSI  (via drill 0.35)
  Top 0.152: U3.19 v21.85,16.81 v21.85,16.8 | v29.92,24.36 32.13,24.36 32.21,24.28 31.64,24.28 U1.27
  Bottom 0.152: v21.85,16.8 22.82,17.76 29.42,24.36 v29.92,24.36
N$1
  Top 0.152: R12.2 16.25,20.48 U3.11
N$2
  Top 0.152: U3.26 26.75,20.09 27.09,20.43 30.87,20.43 R14.1
N$3
  Top 0.152: U3.2 9.95,20.41 9.3,21.05 C16.2
N$4
  Top 0.152: U1.13 23.39,20.09 21.54,20.09 XTAL1.P$1 20.76,20.71 17.96,20.71 17.74,20.93 C3.2
N$5  (1 unrouted)
  Top 0.152: C16.1 10.66,20.44 10.66,19.4
N$6  (1 unrouted)
  Top 0.152: C4.1 20.05,21.61 XTAL1.P$2 21.45,23.01 23.37,23.01 24.15,22.23
N$7
  Top 0.152: C14.2 11.37,18.67 U3.4
N$8  (1 unrouted)
  Top 0.152: C14.1 12.08,21.4 12.08,19.16
N$9
  Top 0.152: R4.1 33.92,22.28 LED1.A
N$10
  Top 0.152: R6.1 35.47,23.12 LED2.A
N$11
  Top 0.4: L1.1 17.6,27.75 17.6,26.02 19.19,24.43 U1.10
N$12
  Top 0.4: U1.9 22.27,25.12 19.54,25.12 18.46,26.2 18.46,26.96 L1.2 19.26,27.79 C1.1
N$13
  Top 0.152: U3.28 28.15,19.89 28.39,20.13 29.72,20.13 C13.2
N$15  (1 unrouted)
  Top 0.152: C15.2 26.71,15.41 27.47,16.17 27.47,18.04
N$17
  Bottom 0.152: R5.2 8.42,9.12 CHRG1.5
N$23
  Top 0.152: U2.12 8.94,5.47 R10.2
N$24
  Top 0.152: R11.2 9.61,3.54 8.91,4.24 U2.11
N$25  (1 unrouted)
  Top 0.152: LED3.C 12.4,8.67
N$26
  Top 0.152: LED4.C 12.37,10.99 R15.2
RESET  (via drill 0.35)
  Top 0.152: 36.71,12.4 R9.1 | R9.1 36.4,10.71 D3.+ 36.56,9.44 C9.2 | U1.35 31.55,30.1 32.87,30.1 v32.88,30.09 | R9.1 35.01,13.48 SW2.1 35.47,14.09 35.47,16.93 36.21,17.67 36.4,17.67 36.76,18.02 36.76,25.54 35.68,26.62 DEBUG1.10
  Bottom 0.152: v32.88,30.09 33.53,29.43 33.53,26.86 34.2,26.19 35.07,26.19 35.68,26.8 DEBUG1.10
RXD.FT
  Top 0.152: R17.1 17.16,12.54 8.44,12.54 4.51,8.62 U2.4
RXD.NRF  (via drill 0.35)
  Top 0.152: U1.21 28.99,23.68 v28.43,24.24 | v18.74,13.09 18.74,12.33 18.85,12.22 18.85,10.94 R16.2
  Bottom 0.152: v28.43,24.24 28.29,24.09 27.43,24.09 18.74,15.41 v18.74,13.09
RXLED
  Top 0.152: U2.17 10.6,8.62 R13.1
SCK  (via drill 0.35)
  Top 0.152: U3.18 21.15,16.34 v21.09,16.28 | v29.75,23.45 30.04,23.73 U1.26
  Bottom 0.152: v21.09,16.28 21.51,16.28 21.6,16.19 22.11,16.19 29.36,23.45 v29.75,23.45
SCL  (via drill 0.35)
  Top 0.152: U1.3 20.84,29.33 v20.82,29.35 | R2.1 5.92,32.39 J2.2
  Bottom 0.152: J2.2 7.19,33.43 7.92,34.17 16.01,34.17 v20.82,29.35
SDA  (via drill 0.35)
  Top 0.152: U1.2 21.57,30.75 v21.57,30.94 | R1.1 2.96,33.36 4.11,33.36 4.17,33.43 J2.1
  Bottom 0.152: J2.1 5.92,33.43 6.96,34.47 18.04,34.47 v21.57,30.94
SWCLK
  Top 0.152: DEBUG1.4 35.68,31.12 36.42,31.86 36.42,32.47 35.99,32.9 34.11,32.9 33.68,32.47 33.68,31.54 32.87,30.73 U1.36
SWDIO  (via drill 0.35)
  Top 0.152: U1.37 31.63,31.57 v32.84,31.57
  Bottom 0.152: v32.84,31.57 32.84,32.94 33.34,33.44 34.41,33.44 DEBUG1.2
SWO  (via drill 0.35)
  Top 0.152: U1.32 v32.87,27.93
  Bottom 0.152: v32.87,27.93 32.95,27.85 32.95,26.9 33.95,25.9 35.53,25.9 36.82,27.18 36.82,29.55 36.75,29.62 DEBUG1.6
TXD.FT
  Top 0.152: U2.20 8.92,10.53 8.92,11.74 9.39,12.22 15.87,12.22 R16.1
TXD.NRF  (via drill 0.35)
  Top 0.152: U1.19 27.59,23.39 v27.68,23.48 | v19.79,13.31 19.79,11.61 R17.2
  Bottom 0.152: v27.68,23.48 27.41,23.48 20.9,16.98 20.93,16.98 19.79,15.85 v19.79,13.31
TXLED  (via drill 0.35)
  Top 0.152: R15.1 10.62,10.21 v11.16,9.67 | v5.78,4.88 3.61,4.88 U2.10
  Bottom 0.152: v5.78,4.88 6.3,4.36 6.3,2.61 7.15,1.76 14.13,1.76 14.38,2.01 14.38,4.65 14.25,4.79 12.81,4.79 11.57,6.03 11.57,9.26 v11.16,9.67
USB+  (via drill 0.35)
  Top 0.152: 12.48,3.57 R11.1 14.18,3.54 | C11.1 14.18,3.54 | v7.23,7.14 7.72,7.14 7.72,1.57 12.21,1.57 14.18,3.54
  Bottom 0.152: USB1.3 5.46,6.91 5.7,7.14 v7.23,7.14
USB-  (via drill 0.35)
  Top 0.152: R10.1 13.91,6.89 14.92,6.89 15.82,5.98 C10.2 15.82,4.49 15.33,4 15.33,2.81 13.79,1.26 7.55,1.26 7.37,1.44 7.37,5.88 6.91,6.34 v6.79,6.34
  Bottom 0.152: USB1.2 4.74,6.32 6.77,6.32 v6.79,6.34
V_USB  (via drill 0.35)
  Top 0.152: U2.15 8.69,7.13 8.24,7.13 8.11,7 8.11,4.53 8.3,4.33 v8.3,4.04
  Bottom 0.152: v8.3,4.04 8.2,4.04 D2.+
  Bottom 0.406: USB1.1 6.5,5.61 6.54,5.57 6.66,5.57 D2.+
VIN  (1 unrouted)
  Bottom 0.152: LDO1.3 12.75,4.28 12.75,4.29 12.6,4.14 12.6,2.33 12.64,2.29
  Bottom 0.508: C6.2 11.8,2.52 11.87,2.45 | 12.64,2.29 13.46,2.29 LDO1.1 | CHRG1.4 10.32,6.95 C5.2
  Bottom 0.6: D2.- D1.- 10.55,3.11 | 10.55,3.11 11.21,3.11 C6.2 | 12.64,2.29 12.03,2.29 11.8,2.52 | C5.2 10.79,5.14 10.73,5.08 10.73,3.28 10.55,3.11
VLIPO  (1 unrouted)
  Top 0.152: R7.2 3.83,17.09 J1.2
  Bottom 0.6: CHRG1.3 10.32,9.46 9.59,8.73 9.59,5.7 9.3,5.41 D1.+ | C8.1 10.2,13.21 8.03,15.39 J1.2

### Text on the board
tNames: +